# EAGLE design Fire-Sensor (EAGLE 6.2)
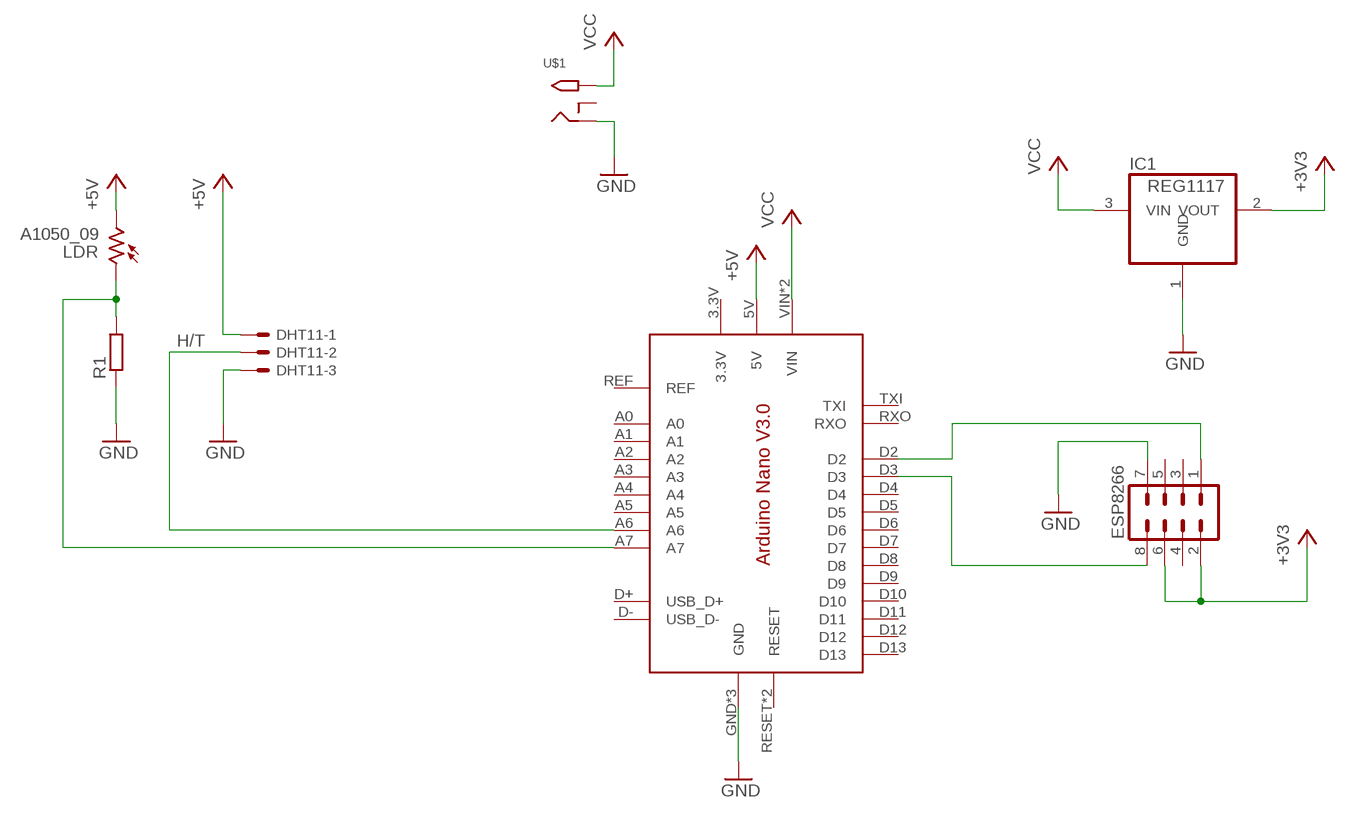
[diagram p0: schematic, sheet 1]

## Parts
ARDUINO  ARDUINO_NANO_V3  [ARDUINO_NANO_V3]
DHT11  KK-156-3  [KK-156-3]
ESP8266  MA04-2  [MA04-2]
IC1  REG1117  [SOT223]
LDR  A1050_09  [T0-46-A10XX]
R1  R-EU_0207/10  [0207/10]
U$1  2.1MMJACK  [PJ-102A]

## Nets
+3V3: ESP8266.2 ESP8266.6 IC1.2(VOUT)
+5V: ARDUINO.5V DHT11.1 LDR.2
GND: ARDUINO.GND ARDUINO.GND1(GND) ARDUINO.GND_USB(GND) DHT11.3 ESP8266.7 IC1.1(GND) R1.1 U$1.RING
H/T: ARDUINO.A6 DHT11.2
N$1: ARDUINO.A7 LDR.1 R1.2
N$4: ARDUINO.D2 ESP8266.1
N$5: ARDUINO.D3 ESP8266.8
VCC: ARDUINO.VIN ARDUINO.VUSB(VIN) IC1.3(VIN) U$1.TIP
Unconnected: ARDUINO.3.3V ARDUINO.A0 ARDUINO.A1 ARDUINO.A2 ARDUINO.A3 ARDUINO.A4 ARDUINO.A5 ARDUINO.D4 ARDUINO.D5 ARDUINO.D6 ARDUINO.D7 ARDUINO.D8 ARDUINO.D9 ARDUINO.D10 ARDUINO.D11 ARDUINO.D12 ARDUINO.D13 ARDUINO.D+(USB_D+) ARDUINO.D-(USB_D-) ARDUINO.REF ARDUINO.RESET ARDUINO.RESET1(RESET) ARDUINO.RXO ARDUINO.TXI ESP8266.3 ESP8266.4 ESP8266.5 U$1.RING_SW

## Library data of the parts
ARDUINO = MimaZ:ARDUINO_NANO_V3
DHT11 = con-molex:KK-156-3: KK 156 HEADER Source: http://www.molex.com/pdm_docs/sd/026604100_sd.pdf; OC_FARNELL: unknown; OC_NEWARK: unknown
ESP8266 = con-lstb:MA04-2: PIN HEADER; OC_FARNELL: unknown; OC_NEWARK: unknown
IC1 = burr-brown:REG1117: 800mA and 1A Low Dropout (LDO) Positive Regulator 1.8V, 2.5V, 2.85V, 3.3V, 5V, and Adj; MPN: REG1117; OC_FARNELL: 1097566; OC_NEWARK: 14P6981
LDR = photo-elements:A10: Sensor Robust Light Sensing Applications Outdoor Light Sensing Application Source: http://optoelectronics.perkinelmer.com/content/Datasheets/DTS_PhotocellsA1050.pdf
R1 = rcl:R-EU_: RESISTOR, European symbol
U$1 = adafruit:2.1MMJACK: 2.1mm x 5.5mm DC jack with internal switch. Digikey part #PJ-102A, 4UCON part #05537 By microbuilder.eu

## Board
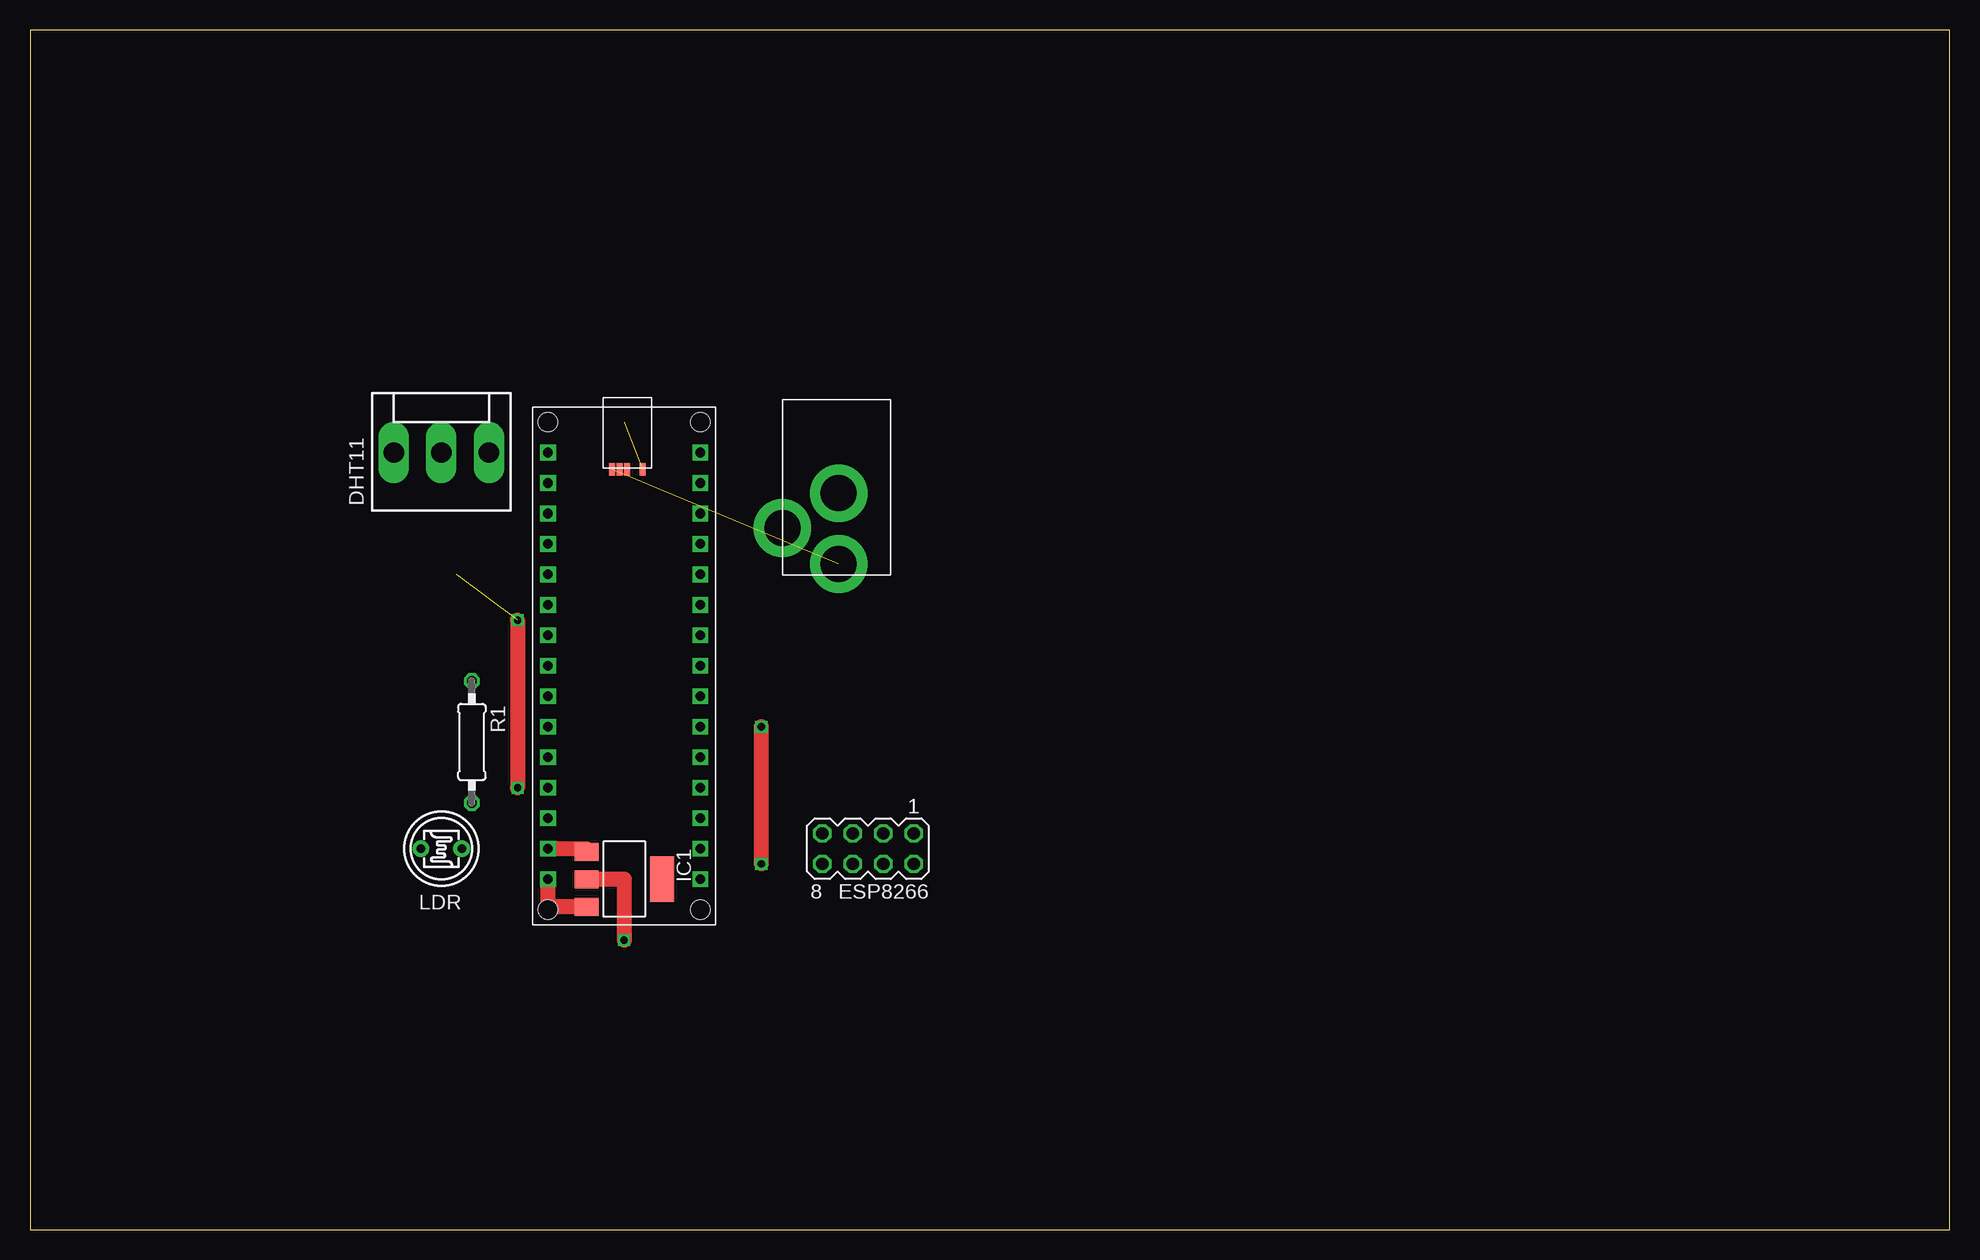
[diagram p1: board, top side]
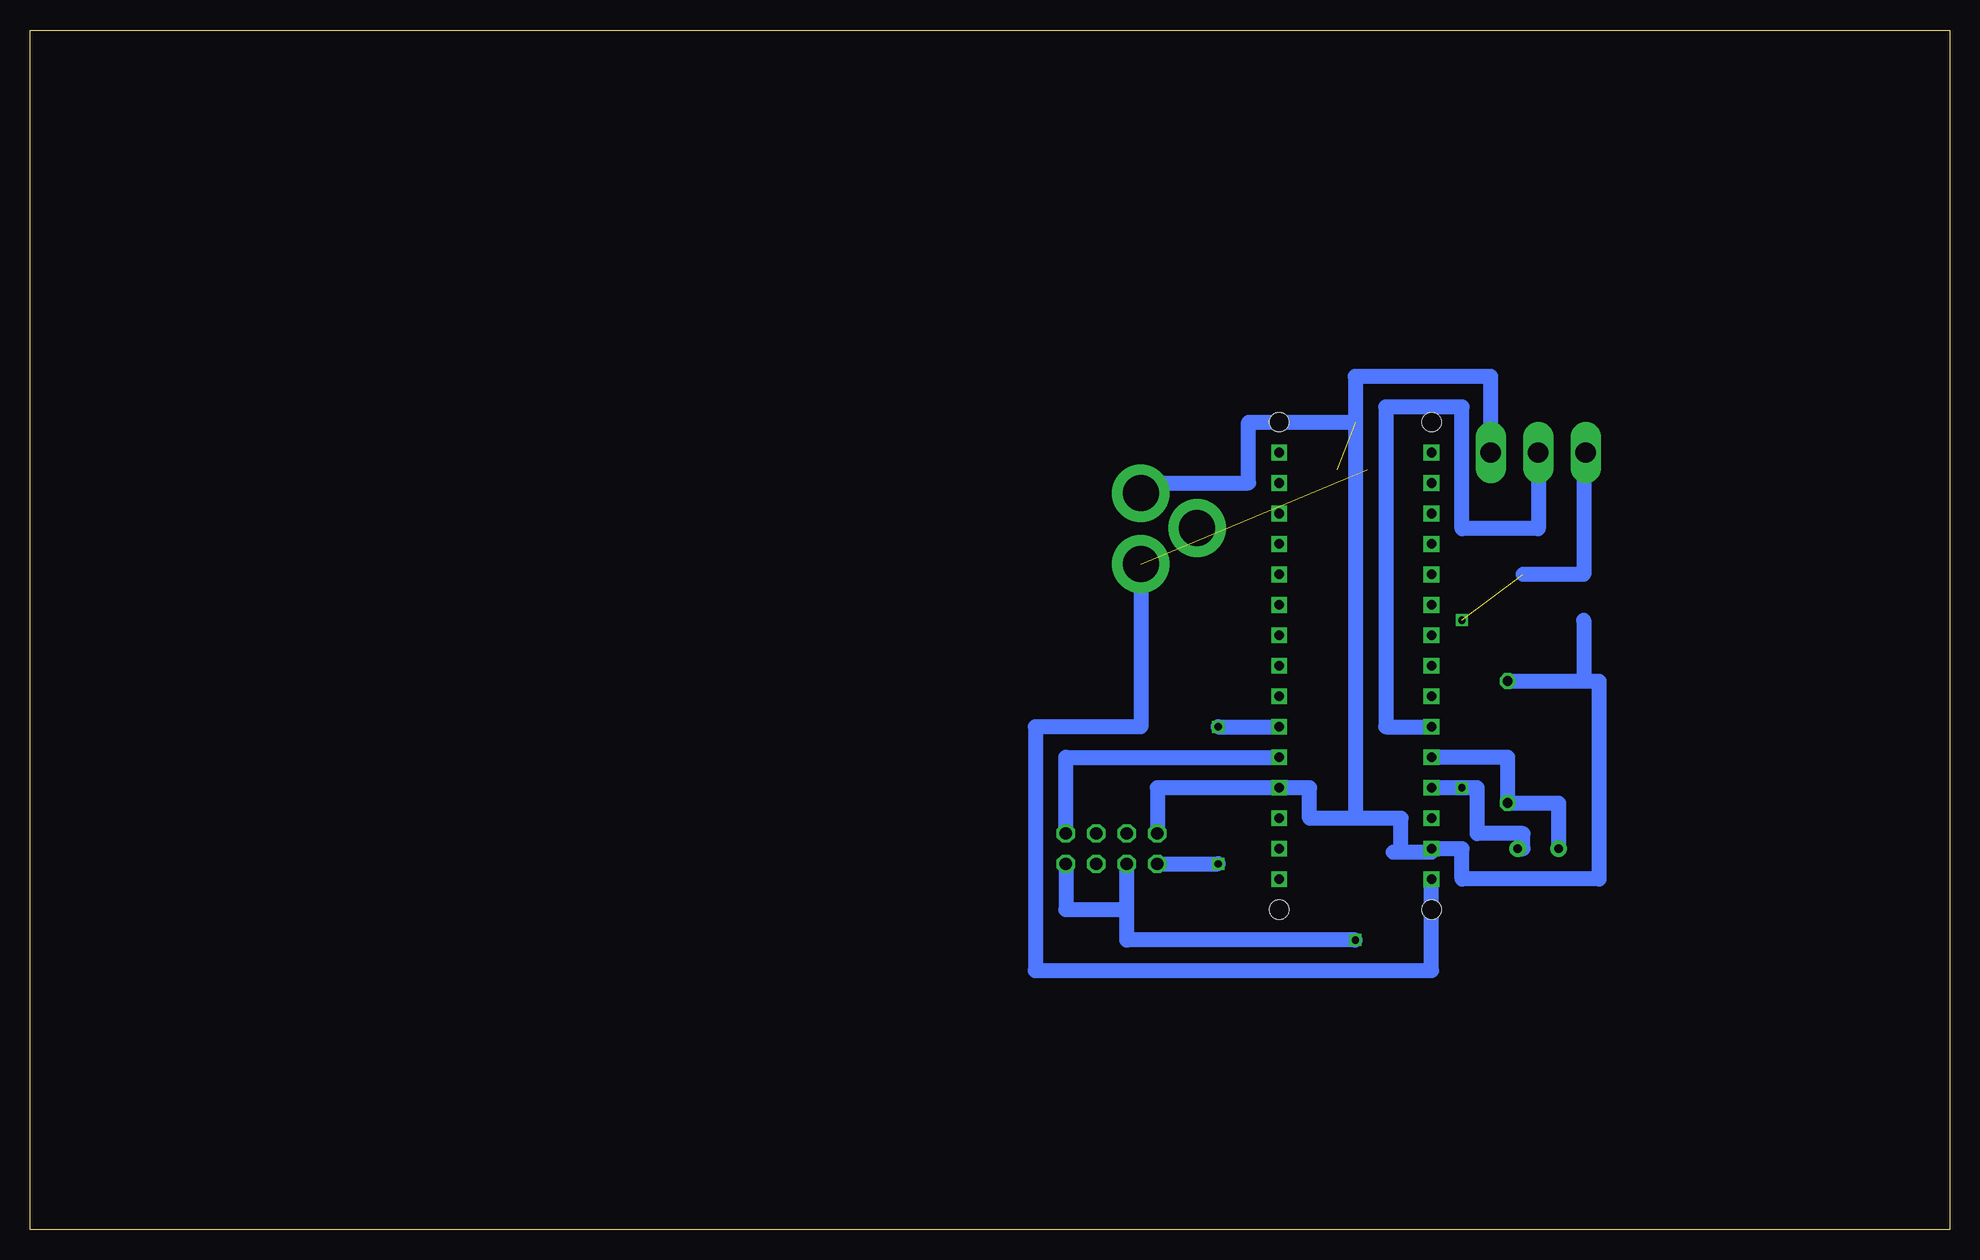
[diagram p2: board, bottom side, seen from below]

Size 160 x 100 mm. Coordinates in mm from the lower left corner, seen from the top.
Outline: 0,0 160,0 160,100 0,100 0,0
Copper layers (1*16): Top 0.035mm / dielectric 1.5mm / Bottom 0.035mm
Design rules: minimum track width 50mil, minimum drill 24mil, track to track 8mil, track to pad 8mil, pad to pad 8mil, via to via 8mil, smd to smd 8mil, copper to edge 40mil, drill to drill 8mil, minimum pad ring 10mil, minimum via ring 8mil, stop-mask expansion 4mil, vias tented up to drill 0mil, thermal gap 10mil

### Footprints (pad centres in the part's own frame; a part is rotated, then mirrored left to right if it is on the bottom)
ARDUINO_NANO_V3 = drill 0.8 square: 3.3V 12.7,-33.02; 5V 12.7,-7.62; A0 12.7,-27.94; A1 12.7,-25.4; A2 12.7,-22.86; A3 12.7,-20.32; A4 12.7,-17.78; A5 12.7,-15.24; A6 12.7,-12.7; A7 12.7,-10.16; D2 0,-10.16; D3 0,-12.7; D4 0,-15.24; D5 0,-17.78; D6 0,-20.32; D7 0,-22.86; D8 0,-25.4; D9 0,-27.94; D10 0,-30.48; D11 0,-33.02; D12 0,-35.56; D13 12.7,-35.56; GND 0,-7.62; GND1 12.7,-2.54; REF 12.7,-30.48; RESET 0,-5.08; RESET1 12.7,-5.08; RXO 0,-2.54; TXI 0,0; VIN 12.7,0 | smd 0.508 x 1.016: D+ 6.096,-34.163; D- 6.731,-34.163; GND_USB 4.826,-34.163; VUSB 7.366,-34.163 | hole 1.6: 0,2.54; 12.7,2.54; 12.7,-38.1; 0,-38.1
KK-156-3 = drill 1.7 pad 2.184 long: 1 -3.96,0; 2 0,0; 3 3.96,0
MA04-2 = drill 1.016 octagon: 1 -3.81,-1.27; 2 -3.81,1.27; 3 -1.27,-1.27; 4 -1.27,1.27; 5 1.27,-1.27; 6 1.27,1.27; 7 3.81,-1.27; 8 3.81,1.27
SOT223 = smd 1.499 x 2.007: 1 -2.261,-3.15; 2 0.025,-3.15; 3 2.311,-3.15 | smd 3.81 x 2.007: 4 0,3.15
T0-46-A10XX = drill 0.7 pad 1.4: 1 -1.7,0; 2 1.7,0
0207/10 = drill 0.813 octagon: 1 -5.08,0; 2 5.08,0
PJ-102A = drill 3 pad 4.8: RING 0.1,-3.39; RING_SW -4.6,-6.29; TIP 0.1,-9.29

### Placement (x,y rotation side)
ARDUINO  55.88,29.21 180 top
DHT11  34.29,64.77 0 top
ESP8266  69.85,31.75 180 top
IC1  49.53,29.21 270 top
LDR  34.29,31.75 0 top
R1  36.83,40.64 270 top
U$1  67.31,64.77 0 top

### Tracks (layer width: path | path; a pad name or v marks a point on that pad's centre or on a via)
+3V3  (via drill 0.6)
  Top 1.27: IC1.2 46.38,29.21 49.53,29.21 v49.53,24.13
  Bottom 1.27: v49.53,24.13 68.58,24.13 68.58,26.67 | 68.58,26.67 ESP8266.6 | ESP8266.2 73.66,26.67 68.58,26.67
+5V  (via drill 0.6)  (1 unrouted)
  Top 1.27: v40.64,50.8 v40.64,36.83
  Bottom 1.27: ARDUINO.5V v40.64,36.83 39.37,36.83 39.37,33.02 35.56,33.02 35.56,31.75 LDR.2 | DHT11.1 30.48,64.77 30.48,54.61 35.56,54.61
GND  (1 unrouted)
  Top 1.27: IC1.1 46.38,31.75 ARDUINO.GND1
  Bottom 1.27: 45.72,31.47 43.18,31.47 ARDUINO.GND1 40.64,31.75 40.64,29.21 29.21,29.21 29.21,45.72 30.48,45.72 | R1.1 30.48,45.72 | 38.1,64.77 DHT11.3 38.25,71.12 49.53,71.12 49.53,67.31 | IC1.1 45.72,31.47 | 45.72,31.47 45.72,34.29 49.53,34.29 | 49.53,34.29 53.34,34.29 53.34,36.83 ARDUINO.GND 66.04,36.83 ESP8266.7 | U$1.RING 67.41,62.23 58.42,62.23 58.42,67.31 49.53,67.31 | 30.48,50.8 30.48,45.72 | 49.53,67.31 49.53,34.29
H/T
  Bottom 1.27: DHT11.2 34.29,58.42 40.64,58.42 40.64,68.58 46.99,68.58 46.99,41.91 ARDUINO.A6
N$1
  Bottom 1.27: ARDUINO.A7 36.83,39.37 R1.2 32.59,35.56 LDR.1
N$4
  Bottom 1.27: ESP8266.1 73.66,39.37 ARDUINO.D2
N$5  (via drill 0.6)
  Top 1.27: v60.96,30.48 v60.96,41.91
  Bottom 1.27: ESP8266.8 v60.96,30.48 | v60.96,41.91 ARDUINO.D3
VCC  (1 unrouted)
  Top 1.27: IC1.3 43.18,26.9 | 43.18,26.9 43.18,26.67 | 43.18,26.9 ARDUINO.VIN
  Bottom 1.27: U$1.TIP 67.41,41.91 76.2,41.91 76.2,21.59 43.18,21.59 ARDUINO.VIN